# Altium schematic sheet ClarinetSensor.SchDoc
size A4
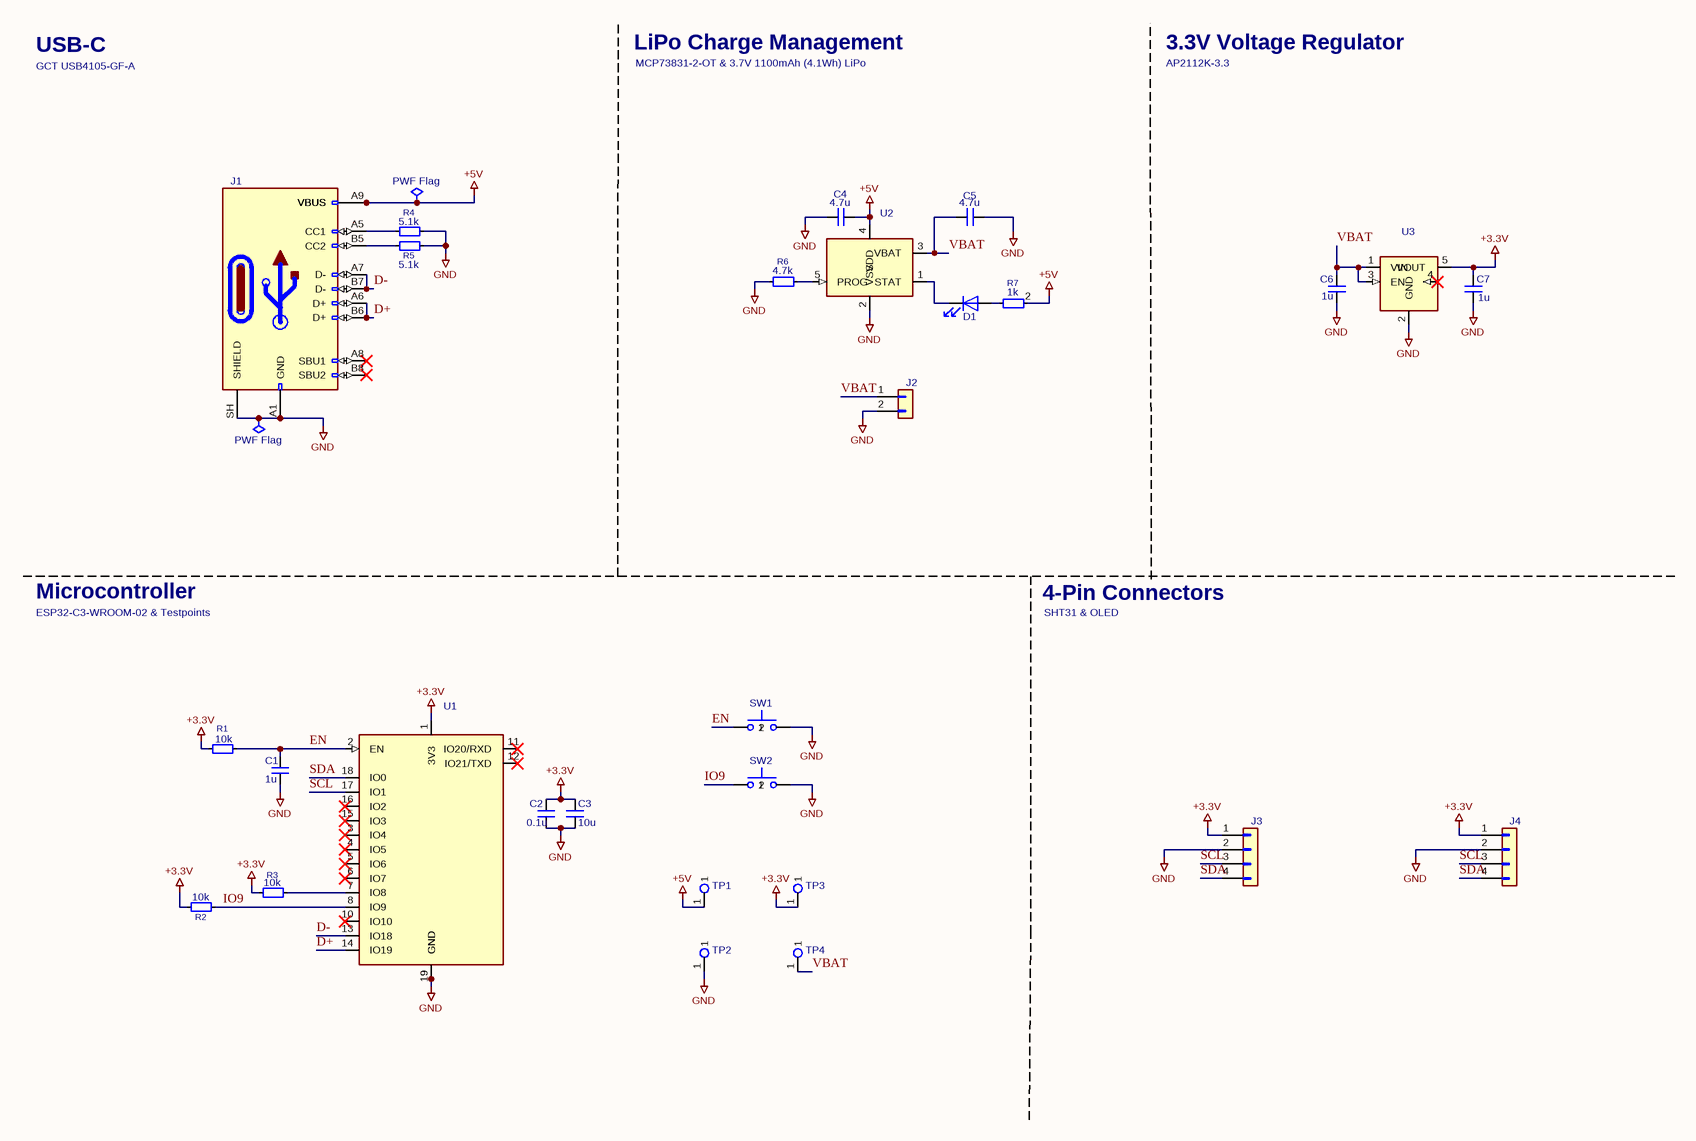
[diagram p0: ClarinetSensor.SchDoc]

## Parts
(Parts that share a designator on the sheet are numbered #1, #2 ... from top to bottom, then left to right.)
C1  1u  [C_0805_2012Metric_Pad1.18x1.45mm_HandSolder]
C2  0.1u  [C_0805_2012Metric_Pad1.18x1.45mm_HandSolder]
C3  10u  [C_0805_2012Metric_Pad1.18x1.45mm_HandSolder]
C4  4.7u  [C_0805_2012Metric_Pad1.18x1.45mm_HandSolder]
C5  4.7u  [C_0805_2012Metric_Pad1.18x1.45mm_HandSolder]
C6  1u  [C_0805_2012Metric_Pad1.18x1.45mm_HandSolder]
C7  1u  [C_0805_2012Metric_Pad1.18x1.45mm_HandSolder]
D1  LED  [LED_0805_2012Metric_Pad1.15x1.40mm_HandSolder]  (value not drawn)
J1  USB_C_Receptacle_USB2.0_16P  [USB_C_Receptacle_GCT_USB4105-xx-A_16P_TopMnt_Horizontal]  (value not drawn)
J2  Conn_01x02  [JST_PH_B2B-PH-K_1x02_P2.00mm_Vertical]  (value not drawn)
J3  SHT31  [PinSocket_1x04_P2.54mm_Vertical]  (value not drawn)
J4  OLED Connector  [PinSocket_1x04_P2.54mm_Vertical]  (value not drawn)
PWF_Flag#1  PWR_FLAG  (value not drawn)  (graphical)
PWF_Flag#2  PWR_FLAG  (value not drawn)  (graphical)
R1  10k  [R_0805_2012Metric_Pad1.20x1.40mm_HandSolder]
R2  10k  [R_0805_2012Metric_Pad1.20x1.40mm_HandSolder]
R3  10k  [R_0805_2012Metric_Pad1.20x1.40mm_HandSolder]
R4  5.1k  [R_0805_2012Metric_Pad1.20x1.40mm_HandSolder]
R5  5.1k  [R_0805_2012Metric_Pad1.20x1.40mm_HandSolder]
R6  4.7k  [R_0805_2012Metric_Pad1.20x1.40mm_HandSolder]
R7  1k  [R_0805_2012Metric_Pad1.20x1.40mm_HandSolder]
SW1  SW_Push  [SW_PUSH_6mm_H5mm]  (value not drawn)
SW2  SW_Push  [SW_PUSH_6mm_H5mm]  (value not drawn)
TP1  5V  [TestPoint_Pad_D2.0mm]  (value not drawn)
TP2  GND  [TestPoint_Pad_D2.0mm]  (value not drawn)
TP3  3.3V  [TestPoint_Pad_D2.0mm]  (value not drawn)
TP4  VBAT  [TestPoint_Pad_D2.0mm]  (value not drawn)
U1  ESP32-C3-WROOM-02  [ESP32-C3-WROOM-02]  (value not drawn)
U2  MCP73831-2-OT  [SOT-23-5_HandSoldering]  (value not drawn)
U3  AP2112K-3.3  [SOT-23-5_HandSoldering]  (value not drawn)

## Nets
+3.3V: C2.1 C3.1 C7.1 J3.1(Pin_1) J4.1(Pin_1) R1.1 R2.1 R3.1 TP3.1 U1.1(3V3) U3.5(VOUT)
+5V: C4.2 J1.A4(VBUS) J1.A9(VBUS) J1.B4(VBUS) J1.B9(VBUS) PWF_Flag#1.1 R7.2 TP1.1 U2.4(VDD)
GND: C1.2 C2.2 C3.2 C4.1 C5.2 C6.2 C7.2 J1.A1(GND) J1.A12(GND) J1.B1(GND) J1.B12(GND) J1.SH(SHIELD) J2.2(Pin_2) J3.2(Pin_2) J4.2(Pin_2) PWF_Flag#2.1 R4.1 R5.1 R6.1 SW1.2 SW2.2 TP2.1 U1.9(GND) U1.19(GND) U2.2(VSS) U3.2(GND)
D+: J1.A6(D+) J1.B6(D+) U1.14(IO19)
D-: J1.A7(D-) J1.B7(D-) U1.13(IO18)
EN: C1.1 R1.2 SW1.1 U1.2(EN)
IO9: R2.2 SW2.1 U1.8(IO9)
SCL: J3.3(Pin_3) J4.3(Pin_3) U1.17(IO1)
SDA: J3.4(Pin_4) J4.4(Pin_4) U1.18(IO0)
VBAT: C5.1 C6.1 J2.1(Pin_1) TP4.1 U2.3(VBAT) U3.1(VIN) U3.3(EN)
NetD1_1: D1.1(K) U2.1(STAT)
NetD1_2: D1.2(A) R7.1
NetJ1_A5: J1.A5(CC1) R4.2
NetJ1_B5: J1.B5(CC2) R5.2
NetR3_2: R3.2 U1.7(IO8)
NetR6_2: R6.2 U2.5(PROG)

Not connected (* = marked no-connect by the designer): J1 A8(SBU1)* B8(SBU2)*; U1 3(IO4)* 4(IO5)* 5(IO6)* 6(IO7)* 10(IO10)* 11(IO20/RXD)* 12(IO21/TXD)* 15(IO3)* 16(IO2)*; U3 4(NC)*

## Notes on the sheet
- USB-C
- LiPo Charge Management
- MCP73831-2-OT & 3.7V 1100mAh (4.1Wh) LiPo
- AP2112K-3.3
- 3.3V Voltage Regulator
- GCT USB4105-GF-A
- ESP32-C3-WROOM-02 & Testpoints
- Microcontroller
- 4-Pin Connectors
- SHT31 & OLED
- 1
- 2
- 3
- 4
- 5
- 6
- A
- B
- C
- https://github.com/AndrewMinWu/ClarinetSensor
- D
- Title: Clarinet Hygrothermometer
- File: ClarinetSensor.kicad_sch
- Sheet: /
- Project Files:
- KiCad E.D.A.  kicad (5.1.4)-1
- Size: A4
- Date: 2026-08-12
- Rev: V1.8
- Id: 1/1

## Library data of the parts
C1-C7 = C_Small: Footprint: Capacitor_SMD:C_0805_2012Metric_Pad1.18x1.45mm_HandSolder
  C1 C6 C7: Value: 1u
  C2: Value: 0.1u
  C3: Value: 10u
  C4 C5: Value: 4.7u
D1 = LED: Sim.Pins: 1=K 2=A; Value: LED; Footprint: LED_SMD:LED_0805_2012Metric_Pad1.15x1.40mm_HandSolder
J3 J4 = Conn_01x04: Footprint: Connector_PinSocket_2.54mm:PinSocket_1x04_P2.54mm_Vertical
  J3: Value: SHT31
  J4: Value: OLED Connector
R1-R7 = R_Small: Footprint: Resistor_SMD:R_0805_2012Metric_Pad1.20x1.40mm_HandSolder
  R1-R3: Value: 10k
  R4 R5: Value: 5.1k
  R6: Value: 4.7k
  R7: Value: 1k
TP1-TP4 = TestPoint: Footprint: TestPoint:TestPoint_Pad_D2.0mm
  TP1: Value: 5V
  TP2: Value: GND
  TP3: Value: 3.3V
  TP4: Value: VBAT
J1 = USB_C_Receptacle_USB2.0_16P: Value: USB_C_Receptacle_USB2.0_16P; Footprint: Connector_USB:USB_C_Receptacle_GCT_USB4105-xx-A_16P_TopMnt_Horizontal
J2 = Conn_01x02: Value: Conn_01x02; Footprint: Connector_JST:JST_PH_B2B-PH-K_1x02_P2.00mm_Vertical
PWF_Flag#1 PWF_Flag#2 = PWR_FLAG: Value: PWR_FLAG
SW1 SW2 = SW_Push: Value: SW_Push; Footprint: Button_Switch_THT:SW_PUSH_6mm_H5mm
U1 = ESP32-C3-WROOM-02: Value: ESP32-C3-WROOM-02; Footprint: RF_Module:ESP32-C3-WROOM-02
U2 = MCP73831-2-OT: Value: MCP73831-2-OT; Footprint: Package_TO_SOT_SMD:SOT-23-5_HandSoldering
U3 = AP2112K-3.3: Value: AP2112K-3.3; Footprint: Package_TO_SOT_SMD:SOT-23-5_HandSoldering